# EAGLE design wolf_rev_c (EAGLE 7.6.0)
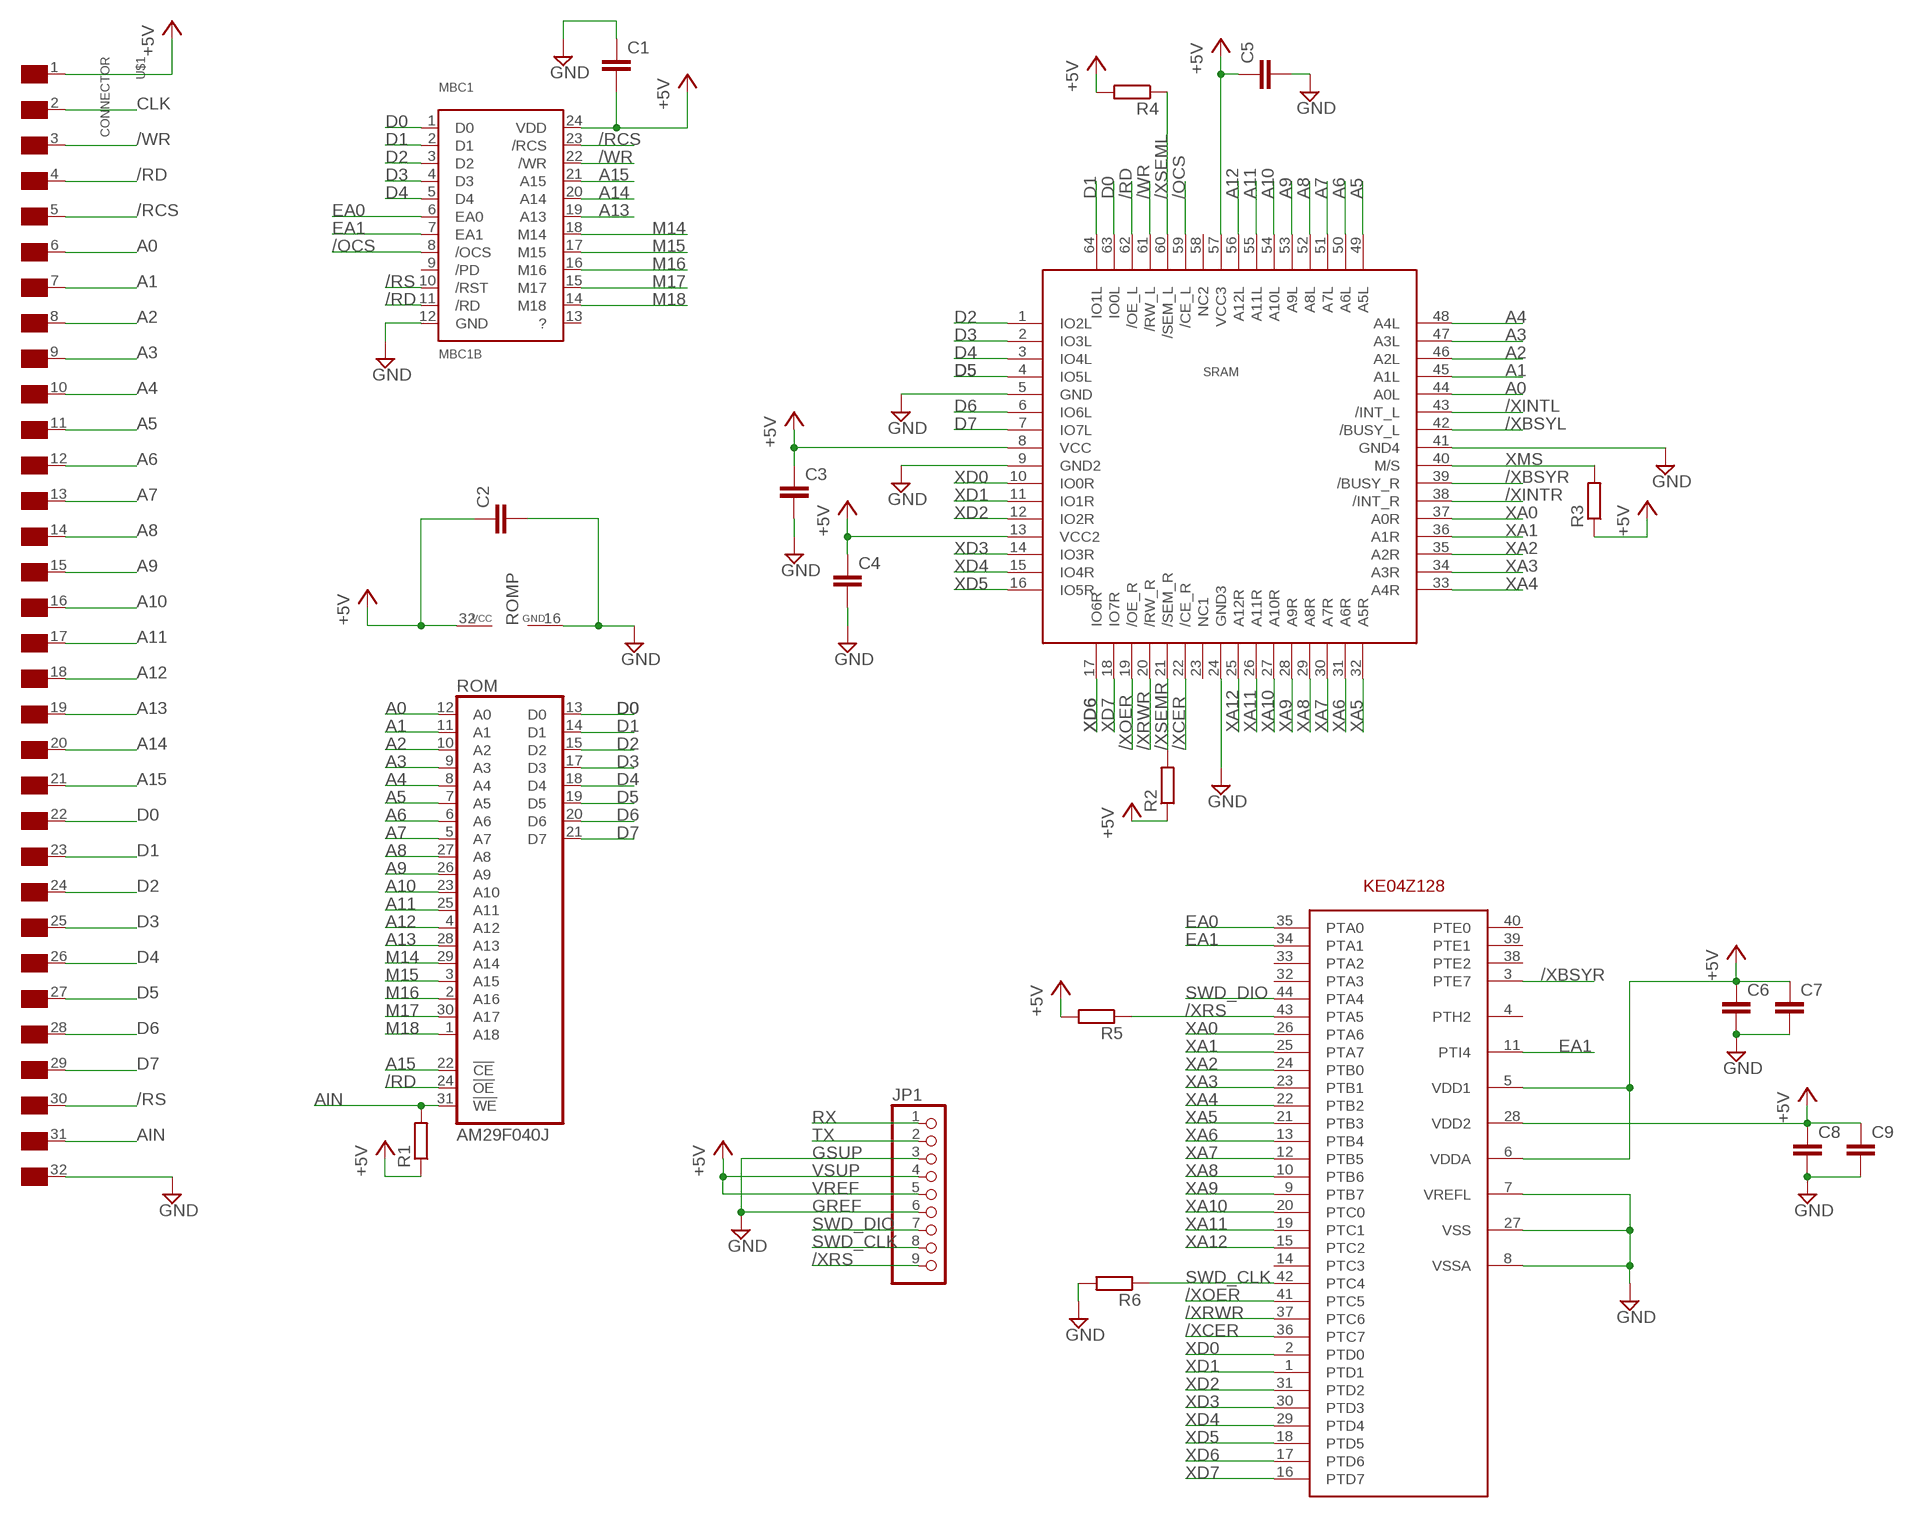
[diagram p0: schematic, sheet 1]

## Parts
C1  C-EUC0805  [C0805]
C2  C-EUC0805  [C0805]
C3  C-EUC0805  [C0805]
C4  C-EUC0805  [C0805]
C5  C-EUC0805  [C0805]
C6  C-EUC0805  [C0805]
C7  C-EUC0805  [C0805]
C8  C-EUC0805  [C0805]
C9  C-EUC0805  [C0805]
JP1  PINHD-1X9  [1X09]
KE04Z128  KE04Z128  KE04Z128VLD4  [TQFP44]
MBC1  MBC1B  [MBC1B]
R1  R-EU_R0805  [R0805]
R2  R-EU_R0805  [R0805]
R3  R-EU_R0805  [R0805]
R4  R-EU_R0805  [R0805]
R5  R-EU_R0805  [R0805]
R6  R-EU_R0805  [R0805]
ROM  AM29F040J  [PLCC32R]
SRAM  CY7C144E  [TQFP64]
U$1  CONNECTOR  [CONNECTOR]

## Nets
+5V [pwr]: C1.2 C2.1 C3.1 C4.1 C5.1 C6.1 C7.1 C8.1 C9.1 JP1.4 JP1.5 KE04Z128.5(VDD1) KE04Z128.6(VDDA) KE04Z128.28(VDD2) MBC1.24(VDD) R1.1 R2.1 R3.1 R4.2 R5.2 ROM.32(VCC) SRAM.8(VCC) SRAM.13(VCC2) SRAM.57(VCC3) U$1.1(VDD)
/OCS: MBC1.8(/OCS) SRAM.59(/CE_L)
/RCS: MBC1.23(/RCS) U$1.5(/RCS)
/RD: MBC1.11(/RD) ROM.24(!OE) SRAM.62(/OE_L) U$1.4(/RD)
/RS: MBC1.10(/RST) U$1.30(/RS)
/WR: MBC1.22(/WR) SRAM.61(/RW_L) U$1.3(/WR)
/XBSYL: SRAM.42(/BUSY_L)
/XBSYR: KE04Z128.3(PTE7) SRAM.39(/BUSY_R)
/XCER: KE04Z128.36(PTC7) SRAM.22(/CE_R)
/XINTL: SRAM.43(/INT_L)
/XINTR: SRAM.38(/INT_R)
/XOER: KE04Z128.41(PTC5) SRAM.19(/OE_R)
/XRS: JP1.9 KE04Z128.43(PTA5) R5.1
/XRWR: KE04Z128.37(PTC6) SRAM.20(/RW_R)
/XSEML: R4.1 SRAM.60(/SEM_L)
/XSEMR: R2.2 SRAM.21(/SEM_R)
A0: ROM.12(A0) SRAM.44(A0L) U$1.6(A0)
A1: ROM.11(A1) SRAM.45(A1L) U$1.7(A1)
A2: ROM.10(A2) SRAM.46(A2L) U$1.8(A2)
A3: ROM.9(A3) SRAM.47(A3L) U$1.9(A3)
A4: ROM.8(A4) SRAM.48(A4L) U$1.10(A4)
A5: ROM.7(A5) SRAM.49(A5L) U$1.11(A5)
A6: ROM.6(A6) SRAM.50(A6L) U$1.12(A6)
A7: ROM.5(A7) SRAM.51(A7L) U$1.13(A7)
A8: ROM.27(A8) SRAM.52(A8L) U$1.14(A8)
A9: ROM.26(A9) SRAM.53(A9L) U$1.15(A9)
A10: ROM.23(A10) SRAM.54(A10L) U$1.16(A10)
A11: ROM.25(A11) SRAM.55(A11L) U$1.17(A11)
A12: ROM.4(A12) SRAM.56(A12L) U$1.18(A12)
A13: MBC1.19(A13) ROM.28(A13) U$1.19(A13)
A14: MBC1.20(A14) U$1.20(A14)
A15: MBC1.21(A15) ROM.22(!CE) U$1.21(A15)
AIN: R1.2 ROM.31(!WE) U$1.31(VIN)
CLK: U$1.2(NC)
D0: MBC1.1(D0) ROM.13(D0) SRAM.63(IO0L) U$1.22(D0)
D1: MBC1.2(D1) ROM.14(D1) SRAM.64(IO1L) U$1.23(D1)
D2: MBC1.3(D2) ROM.15(D2) SRAM.1(IO2L) U$1.24(D2)
D3: MBC1.4(D3) ROM.17(D3) SRAM.2(IO3L) U$1.25(D3)
D4: MBC1.5(D4) ROM.18(D4) SRAM.3(IO4L) U$1.26(D4)
D5: ROM.19(D5) SRAM.4(IO5L) U$1.27(D5)
D6: ROM.20(D6) SRAM.6(IO6L) U$1.28(D6)
D7: ROM.21(D7) SRAM.7(IO7L) U$1.29(D7)
EA0: KE04Z128.35(PTA0) MBC1.6(EA0)
EA1: KE04Z128.11(PTI4) KE04Z128.34(PTA1) MBC1.7(EA1)
GND [gnd]: C1.1 C2.2 C3.2 C4.2 C5.2 C6.2 C7.2 C8.2 C9.2 JP1.3 JP1.6 KE04Z128.7(VREFL) KE04Z128.8(VSSA) KE04Z128.27(VSS) MBC1.12(GND) R6.2 ROM.16(GND) SRAM.5(GND) SRAM.9(GND2) SRAM.24(GND3) SRAM.41(GND4) U$1.32(GND)
M14: MBC1.18(M14) ROM.29(A14)
M15: MBC1.17(M15) ROM.3(A15)
M16: MBC1.16(M16) ROM.2(A16)
M17: MBC1.15(M17) ROM.30(A17)
M18: MBC1.14(M18) ROM.1(A18)
RX: JP1.1
SWD_CLK: JP1.8 KE04Z128.42(PTC4) R6.1
SWD_DIO: JP1.7 KE04Z128.44(PTA4)
TX: JP1.2
XA0: KE04Z128.26(PTA6) SRAM.37(A0R)
XA1: KE04Z128.25(PTA7) SRAM.36(A1R)
XA2: KE04Z128.24(PTB0) SRAM.35(A2R)
XA3: KE04Z128.23(PTB1) SRAM.34(A3R)
XA4: KE04Z128.22(PTB2) SRAM.33(A4R)
XA5: KE04Z128.21(PTB3) SRAM.32(A5R)
XA6: KE04Z128.13(PTB4) SRAM.31(A6R)
XA7: KE04Z128.12(PTB5) SRAM.30(A7R)
XA8: KE04Z128.10(PTB6) SRAM.29(A8R)
XA9: KE04Z128.9(PTB7) SRAM.28(A9R)
XA10: KE04Z128.20(PTC0) SRAM.27(A10R)
XA11: KE04Z128.19(PTC1) SRAM.26(A11R)
XA12: KE04Z128.15(PTC2) SRAM.25(A12R)
XD0: KE04Z128.2(PTD0) SRAM.10(IO0R)
XD1: KE04Z128.1(PTD1) SRAM.11(IO1R)
XD2: KE04Z128.31(PTD2) SRAM.12(IO2R)
XD3: KE04Z128.30(PTD3) SRAM.14(IO3R)
XD4: KE04Z128.29(PTD4) SRAM.15(IO4R)
XD5: KE04Z128.18(PTD5) SRAM.16(IO5R)
XD6: KE04Z128.17(PTD6) SRAM.17(IO6R)
XD7: KE04Z128.16(PTD7) SRAM.18(IO7R)
XMS: R3.2 SRAM.40(M/S)
Unconnected: KE04Z128.4(PTH2) KE04Z128.14(PTC3) KE04Z128.32(PTA3) KE04Z128.33(PTA2) KE04Z128.38(PTE2) KE04Z128.39(PTE1) KE04Z128.40(PTE0) MBC1.9(/PD) MBC1.13(?) SRAM.23(NC1) SRAM.58(NC2)

## Notes on the sheet
- GSUP
- VSUP
- VREF
- GREF

## Library data of the parts
C1-C9 = resistor:C-EU: CAPACITOR, European symbol
JP1 = pinhead:PINHD-1X9: PIN HEADER
KE04Z128 = wolf_rev_c:KE04Z128VLD4
MBC1 = wolf_rev_c:MBC1B: Nintendo Gameboy cartridge Memory Bank Controller (MBC) Specifically based on the MBC1-B chip
R1-R6 = resistor:R-EU_: RESISTOR, European symbol
ROM = am29-memory:AM29F040J: 4-Megabit FLASH MEMORY (512 K x 8 bit) 5 V-only
SRAM = wolf_rev_c:CY7C144E
U$1 = gameboy:CONNECTOR: Connector Pads for Gameboy Cartridges

## Net classes
1 pwr: width 0.406 mm
2 gnd: width 0.406 mm

## Board
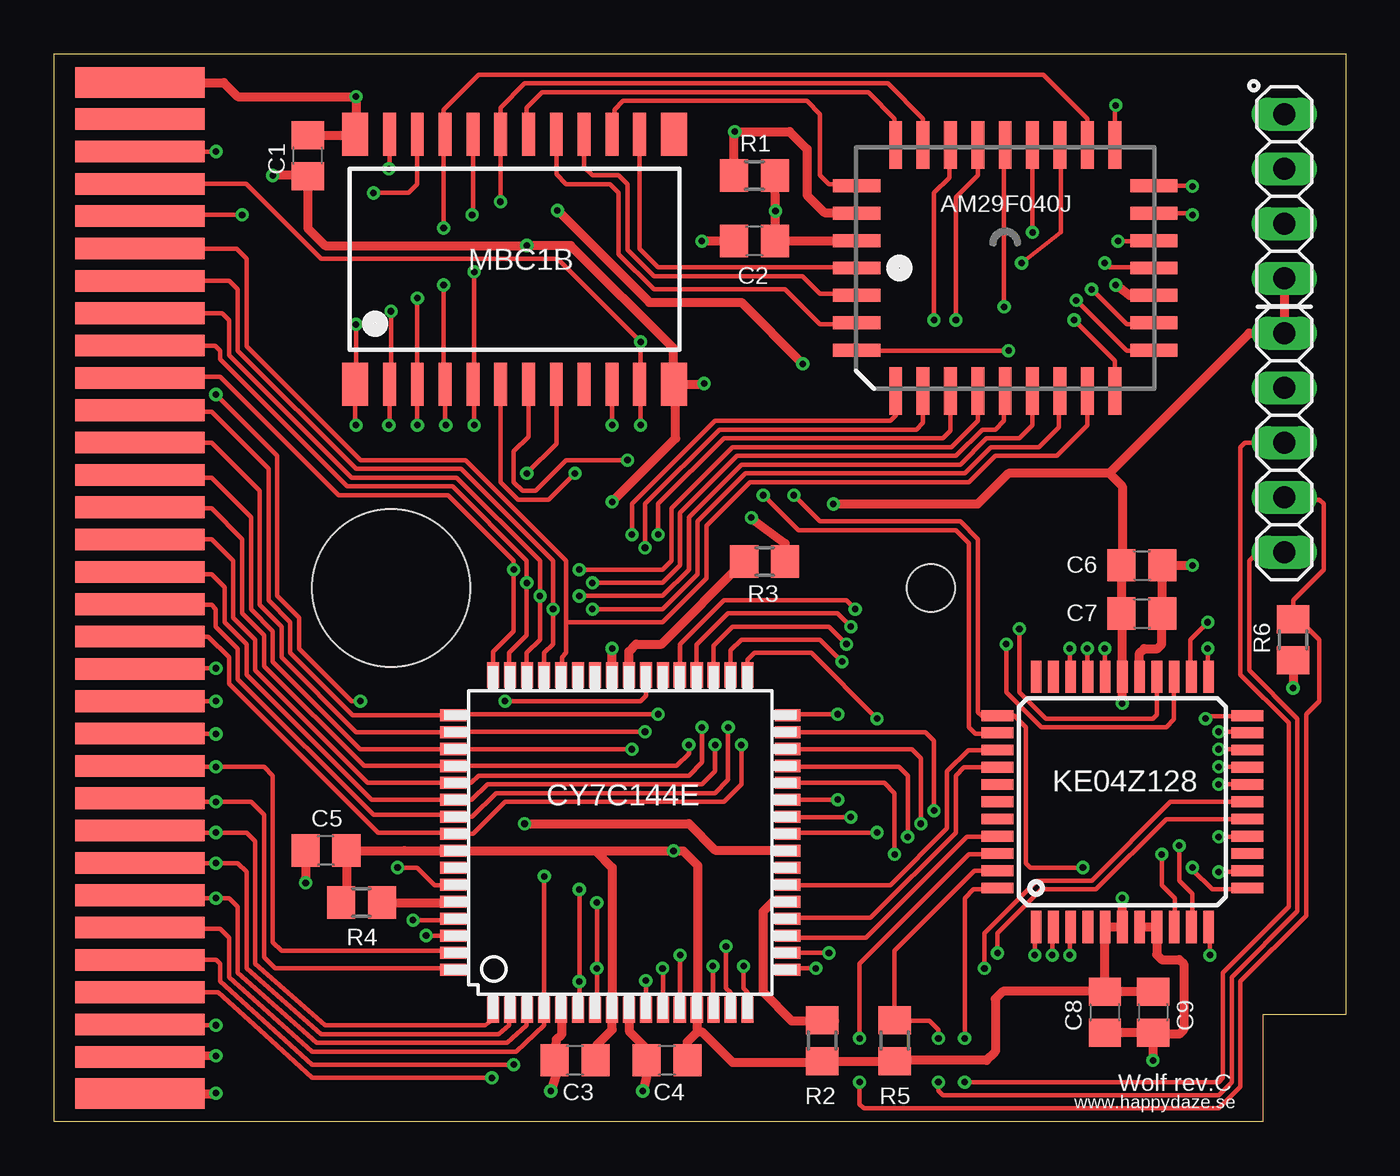
[diagram p1: board, top side]
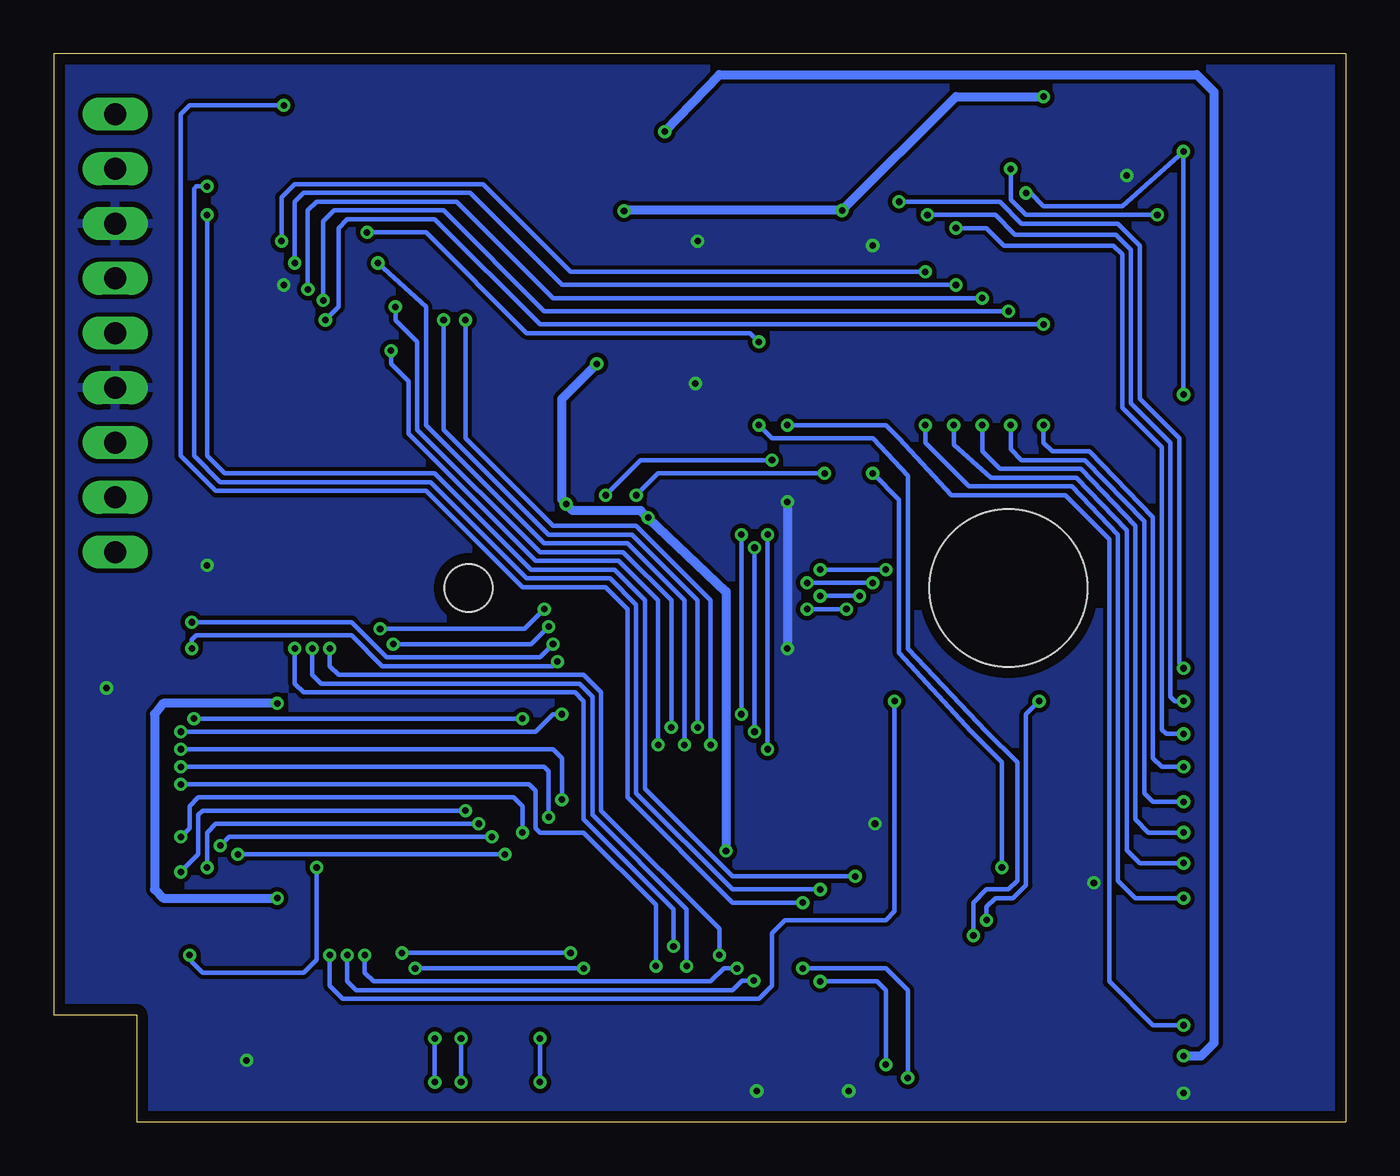
[diagram p2: board, bottom side, seen from below]

Size 59.94 x 49.53 mm. Coordinates in mm from the lower left corner, seen from the top.
Outline: 59.94,4.95 56.11,4.95 56.11,0 0,0 0,49.53 59.94,49.53 59.94,4.95
Copper layers (1*16): Top 0.035mm / dielectric 1.6mm / Bottom 0.035mm
Design rules "Elecrow_2-layer_PCB_eagle_rule *": minimum track width 8mil, minimum drill 12mil, track to track 8mil, track to pad 8mil, pad to pad 8mil, via to via 8mil, smd to smd 0mil, copper to edge 20mil, drill to drill 10mil, minimum pad ring 6mil, minimum via ring 6mil, stop-mask expansion 0mil, vias tented up to drill 100mil, thermal gap 10mil
Holes 7.3 mm at 15.65,24.75
Holes 2.2 mm at 40.7,24.75

### Footprints (pad centres in the part's own frame; a part is rotated, then mirrored left to right if it is on the bottom)
C0805 = smd 1.3 x 1.5: 1 -0.95,0; 2 0.95,0
1X09 = drill 1.016 long: 1 -10.16,0; 2 -7.62,0; 3 -5.08,0; 4 -2.54,0; 5 0,0; 6 2.54,0; 7 5.08,0; 8 7.62,0; 9 10.16,0
TQFP44 = smd 1.5 x 0.5: 1 -5.8,4; 2 -5.8,3.2; 3 -5.8,2.4; 4 -5.8,1.6; 5 -5.8,0.8; 6 -5.8,0; 7 -5.8,-0.8; 8 -5.8,-1.6; 9 -5.8,-2.4; 10 -5.8,-3.2; 11 -5.8,-4; 23 5.8,-4; 24 5.8,-3.2; 25 5.8,-2.4; 26 5.8,-1.6; 27 5.8,-0.8; 28 5.8,0; 29 5.8,0.8; 30 5.8,1.6; 31 5.8,2.4; 32 5.8,3.2; 33 5.8,4 | smd 0.5 x 1.5: 12 -4,-5.8; 13 -3.2,-5.8; 14 -2.4,-5.8; 15 -1.6,-5.8; 16 -0.8,-5.8; 17 0,-5.8; 18 0.8,-5.8; 19 1.6,-5.8; 20 2.4,-5.8; 21 3.2,-5.8; 22 4,-5.8; 34 4,5.8; 35 3.2,5.8; 36 2.4,5.8; 37 1.6,5.8; 38 0.8,5.8; 39 0,5.8; 40 -0.8,5.8; 41 -1.6,5.8; 42 -2.4,5.8; 43 -3.2,5.8; 44 -4,5.8
MBC1B = smd 2 x 1.2: 1 1,-0.6; 12 1,-15.39; 13 12.6,-15.39; 24 12.6,-0.6 | smd 2 x 0.6: 2 1,-2.19; 3 1,-3.48; 4 1,-4.77; 5 1,-6.06; 6 1,-7.35; 7 1,-8.64; 8 1,-9.93; 9 1,-11.22; 10 1,-12.51; 11 1,-13.8; 14 12.6,-13.8; 15 12.6,-12.51; 16 12.6,-11.22; 17 12.6,-9.93; 18 12.6,-8.64; 19 12.6,-7.35; 20 12.6,-6.06; 21 12.6,-4.77; 22 12.6,-3.48; 23 12.6,-2.19
R0805 = smd 1.3 x 1.5: 1 -0.95,0; 2 0.95,0
PLCC32R = smd 0.6 x 2.2: 1 0,6.9; 2 -1.27,6.9; 3 -2.54,6.9; 4 -3.81,6.9; 14 -3.81,-6.9; 15 -2.54,-6.9; 16 -1.27,-6.9; 17 0,-6.9; 18 1.27,-6.9; 19 2.54,-6.9; 20 3.81,-6.9; 30 3.81,6.9; 31 2.54,6.9; 32 1.27,6.9 | smd 2.2 x 0.6: 5 -5.7,5.08; 6 -5.7,3.81; 7 -5.7,2.54; 8 -5.7,1.27; 9 -5.7,0; 10 -5.7,-1.27; 11 -5.7,-2.54; 12 -5.7,-3.81; 13 -5.7,-5.08; 21 5.7,-5.08; 22 5.7,-3.81; 23 5.7,-2.54; 24 5.7,-1.27; 25 5.7,0; 26 5.7,1.27; 27 5.7,2.54; 28 5.7,3.81; 29 5.7,5.08
TQFP64 = smd 1.194 x 0.559: 1 -7.76,5.905; 2 -7.76,5.118; 3 -7.76,4.331; 4 -7.76,3.543; 5 -7.76,2.756; 6 -7.76,1.968; 7 -7.76,1.181; 8 -7.76,0.394; 9 -7.76,-0.394; 10 -7.76,-1.181; 11 -7.76,-1.968; 12 -7.76,-2.756; 13 -7.76,-3.543; 14 -7.76,-4.331; 15 -7.76,-5.118; 16 -7.76,-5.905; 33 7.76,-5.905; 34 7.76,-5.118; 35 7.76,-4.331; 36 7.76,-3.543; 37 7.76,-2.756; 38 7.76,-1.968; 39 7.76,-1.181; 40 7.76,-0.394; 41 7.76,0.394; 42 7.76,1.181; 43 7.76,1.968; 44 7.76,2.756; 45 7.76,3.543; 46 7.76,4.331; 47 7.76,5.118; 48 7.76,5.905 | smd 0.559 x 1.194: 17 -5.905,-7.76; 18 -5.118,-7.76; 19 -4.331,-7.76; 20 -3.543,-7.76; 21 -2.756,-7.76; 22 -1.968,-7.76; 23 -1.181,-7.76; 24 -0.394,-7.76; 25 0.394,-7.76; 26 1.181,-7.76; 27 1.968,-7.76; 28 2.756,-7.76; 29 3.543,-7.76; 30 4.331,-7.76; 31 5.118,-7.76; 32 5.905,-7.76; 49 5.905,7.76; 50 5.118,7.76; 51 4.331,7.76; 52 3.543,7.76; 53 2.756,7.76; 54 1.968,7.76; 55 1.181,7.76; 56 0.394,7.76; 57 -0.394,7.76; 58 -1.181,7.76; 59 -1.968,7.76; 60 -2.756,7.76; 61 -3.543,7.76; 62 -4.331,7.76; 63 -5.118,7.76; 64 -5.905,7.76
CONNECTOR = smd 1.4 x 6: 1 0.7,-3; 32 47.6,-3 | smd 1 x 6: 2 2.4,-3; 3 3.9,-3; 4 5.4,-3; 5 6.9,-3; 6 8.4,-3; 7 9.9,-3; 8 11.4,-3; 9 12.9,-3; 10 14.4,-3; 11 15.9,-3; 12 17.4,-3; 13 18.9,-3; 14 20.4,-3; 15 21.9,-3; 16 23.4,-3; 17 24.9,-3; 18 26.4,-3; 19 27.9,-3; 20 29.4,-3; 21 30.9,-3; 22 32.4,-3; 23 33.9,-3; 24 35.4,-3; 25 36.9,-3; 26 38.4,-3; 27 39.9,-3; 28 41.4,-3; 29 42.9,-3; 30 44.4,-3; 31 45.9,-3

### Placement (x,y rotation side)
C1  11.79,44.81 90 top
C2  32.51,40.84 180 top
C3  24.18,2.84 180 top
C4  28.45,2.84 180 top
C5  12.62,12.57 180 top
C6  50.5,25.81 0 top
C7  50.5,23.57 0 top
C8  48.77,5.08 270 top
C9  51,5.08 270 top
JP1  57.1,36.58 270 top
KE04Z128  49.58,14.83 90 top
MBC1  13.39,33.2 90 top
R1  32.51,43.89 180 top
R2  35.66,3.76 90 top
R3  32.99,25.99 180 top
R4  14.27,10.16 180 top
R5  39.01,3.76 270 top
R6  57.51,22.35 270 top
ROM  44.15,39.6 90 top
SRAM  26.29,12.95 90 top
U$1  7,48.9 270 top

### Tracks (layer width: path | path; a pad name or v marks a point on that pad's centre or on a via)
+5V  (via drill 0.3 pad 0.3)
  Top 0.406: C3.1 25.21,3.57 25.91,4.27 SRAM.8 25.91,5.21 25.91,11.79 25.13,12.56 | C4.1 29.4,3.69 29.87,4.17 | 29.87,4.17 29.87,5.16 SRAM.13 29.87,5.23 29.87,11.89 29.2,12.56 v28.75,12.56 25.13,12.56 | 16.26,12.57 C5.1 13.57,9.81 R4.2 | 16.26,12.57 18.52,12.57 SRAM.57 25.13,12.56 | 16.24,12.56 16.26,12.57 | C1.2 13.94,45.76 MBC1.24 14.02,45.83 v14.02,47.55 8.53,47.55 7.88,48.2 U$1.1 | 33.48,42.05 C2.1 33.49,40.87 ROM.32 | 33.48,42.05 v33.49,42.24 | v33.49,42.24 R1.1 | v23.37,42.27 27.64,38 31.9,38 v34.75,35.15 | v33.49,42.24 33.49,42.06 33.48,42.05 | v36.17,28.65 42.88,28.65 44.3,30.07 48.97,30.07 | v32.37,28.02 32.33,28.02 33.93,26.82 R3.1 | 29.87,4.17 30.07,4.17 31.5,2.74 36.2,2.74 R2.1 R5.2 39.66,2.85 43.28,2.85 43.69,3.25 43.69,5.69 44.04,6.04 48.78,6.04 | C9.1 C8.1 48.78,6.04 | 48.97,30.07 49.58,29.46 49.58,25.84 C6.1 C7.1 49.58,23.54 KE04Z128.28 | 48.97,30.07 55.47,36.58 JP1.5 JP1.4 | 49.55,20.67 KE04Z128.28 | v49.58,19.41 KE04Z128.28 | KE04Z128.6 49.58,8.94 | KE04Z128.6 KE04Z128.5 48.78,6.04 | KE04Z128.6 v49.58,10.36
  Bottom 0.406: v14.02,47.55 18.09,47.55 v23.37,42.27 33.46,42.27 v33.49,42.24 | v28.75,12.56 28.75,24.59 v32.37,28.02 32.72,28.35 35.87,28.35 v36.17,28.65 36.37,28.85 36.37,33.53 v34.75,35.15 | v49.58,19.41 54.86,19.41 55.27,18.9 55.27,10.77 54.86,10.36 v49.58,10.36
/OCS  (via drill 0.3 pad 0.3)
  Top 0.203: MBC1.8 23.32,31.44 v21.95,30.07 | SRAM.59 18.52,10.97 17.68,10.97 16.87,11.79 v15.95,11.79
  Bottom 0.203: v15.95,11.79 15.95,16.66 17.37,18.09 20.73,21.74 20.73,28.85 v21.95,30.07
/RCS  (via drill 0.3 pad 0.3)
  Top 0.203: MBC1.23 15.58,44.23 v15.54,44.2 | v8.74,42.06 4.06,42.06 U$1.5
  Bottom 0.203: v15.54,44.2 15.54,42.77 14.83,42.06 v8.74,42.06
/RD  (via drill 0.3 pad 0.3)
  Top 0.203: U$1.4 8.93,43.5 12.39,40.03 23.37,40.03 v27.23,36.17 27.23,34.24 MBC1.11 27.23,34.16 v27.23,32.31 | SRAM.62 17.29,8.62 v17.27,8.64 | v45.41,41.25 ROM.24
  Bottom 0.203: v17.27,8.64 17.27,10.16 16.66,10.77 15.65,10.77 15.24,11.18 15.24,16.66 16.66,18.09 20.32,21.95 20.32,29.97 21.95,31.7 26.62,31.7 v27.23,32.31 | v27.23,36.17 27.64,36.58 38,36.58 42.67,41.25 v45.41,41.25
/RS  (via drill 0.3 pad 0.3)
  Top 0.203: v7.52,4.47 4.03,4.47 U$1.30 | v25.91,32.31 25.9,32.31 MBC1.10
  Bottom 0.203: v25.91,32.31 21.34,32.31 20.73,31.7 18.29,29.06 13.01,29.06 10.97,27.03 10.97,6.5 8.94,4.47 v7.52,4.47
/WR  (via drill 0.3 pad 0.3)
  Top 0.203: U$1.3 v7.53,45 | MBC1.22 16.87,43.48 16.46,43.08 v14.83,43.08 | MBC1.22 | v7.52,33.73 10.36,30.89 10.36,24.38 11.38,23.37 11.38,21.95 13.82,19.51 v14.22,19.51 | v16.66,9.35 18.47,9.35 SRAM.61
  Bottom 0.203: v14.83,43.08 14.63,43.08 14.02,42.47 10.36,42.47 v7.53,45 7.53,33.52 v7.52,33.73 | v16.66,9.35 16.66,9.96 16.26,10.36 15.44,10.36 14.83,10.97 14.83,18.9 v14.22,19.51
/XBSYR  (via drill 0.3 pad 0.3)
  Top 0.203: v47.14,7.72 47.14,8.99 KE04Z128.3 | SRAM.39 27.47,19.75 27.23,19.51 v20.93,19.51
  Bottom 0.203: v47.14,7.72 47.14,6.3 46.53,5.69 27.23,5.69 26.62,6.3 26.62,8.74 26.01,9.35 21.34,9.35 20.93,9.75 v20.93,19.51
/XCER
  Top 0.203: KE04Z128.36 42.43,17.23 41.45,16.26 41.45,13.61 38.81,10.97 34.06,10.97 SRAM.22
/XOER
  Top 0.203: SRAM.19 34.14,8.53 37.69,8.53 42.37,13.21 43.76,13.21 KE04Z128.41
/XRS  (via drill 0.3 pad 0.3)
  Top 0.203: KE04Z128.43 42.72,11.63 39.01,7.92 R5.1 39.05,4.67 40.64,4.67 41.05,4.27 v41.05,3.86 | JP1.9 55.88,26.42 55.47,26.01 55.47,20.93 57.71,18.69 57.71,9.75 54.66,6.71 54.66,1.83 54.05,1.22 41.25,1.22 41.05,1.42 v41.05,1.83
  Bottom 0.203: v41.05,1.83 v41.05,3.86
/XRWR
  Top 0.203: KE04Z128.37 42.24,16.43 41.86,16.05 41.86,13.41 37.9,9.45 34.09,9.45 SRAM.20 34.11,9.35
/XSEML
  Top 0.406: R4.1 18.49,10.16 SRAM.60
/XSEMR
  Top 0.406: SRAM.21 34.01,10.16 33.33,10.16 32.92,9.75 32.92,5.99 34.24,4.67 36.24,4.67 R2.2
A0
  Top 0.203: U$1.6 8.47,40.5 8.94,40.03 8.94,35.97 14.22,30.68 19.1,30.68 23.77,26.01 23.77,23.16 | SRAM.44 23.57,20.75 23.57,21.54 23.77,21.74 23.77,23.16 | ROM.12 47.95,32.31 46.53,30.89 43.69,30.89 42.47,29.67 32.31,29.67 30.28,27.64 30.28,25.2 28.25,23.16 23.77,23.16
A1  (via drill 0.3 pad 0.3)
  Top 0.203: U$1.7 8.14,39 8.53,38.61 8.53,35.76 14.02,30.28 18.9,30.28 23.16,26.01 v23.16,23.77 23.16,22.15 22.76,21.74 22.76,20.73 SRAM.45 | ROM.11 46.63,33.85 46.63,32.21 45.72,31.29 43.48,31.29 42.27,30.07 32.11,30.07 29.87,27.84 29.87,25.4 28.25,23.77 v24.99,23.77
  Bottom 0.203: v23.16,23.77 v24.99,23.77
A2  (via drill 0.3 pad 0.3)
  Top 0.203: U$1.8 7.81,37.5 8.13,37.19 8.13,35.56 13.82,29.87 18.69,29.87 22.55,26.01 v22.55,24.38 22.55,22.35 21.95,21.74 21.95,20.73 SRAM.46 | ROM.10 45.41,32.31 44.81,31.7 43.28,31.7 42.06,30.48 31.9,30.48 29.46,28.04 29.46,25.6 28.25,24.38 v24.38,24.38
  Bottom 0.203: v22.55,24.38 v24.38,24.38
A3  (via drill 0.3 pad 0.3)
  Top 0.203: U$1.9 7.49,36 7.72,35.76 7.72,35.36 13.61,29.46 18.49,29.46 21.95,26.01 v21.95,24.99 21.95,22.55 21.13,21.74 21.13,20.75 SRAM.47 | ROM.9 44.09,33.85 44.09,32.51 43.69,32.11 43.08,32.11 41.86,30.89 31.7,30.89 29.06,28.25 29.06,25.81 28.25,24.99 v24.99,24.99
  Bottom 0.203: v21.95,24.99 v24.99,24.99
A4  (via drill 0.3 pad 0.3)
  Top 0.203: U$1.10 4.04,34.54 7.72,34.54 13.21,29.06 18.29,29.06 21.34,26.01 v21.34,25.6 21.34,22.76 20.38,21.81 SRAM.48 | ROM.8 42.88,32.51 41.66,31.29 31.5,31.29 28.65,28.45 28.65,26.01 28.25,25.6 v24.38,25.6
  Bottom 0.203: v21.34,25.6 v24.38,25.6
A5  (via drill 0.3 pad 0.3)
  Top 0.203: U$1.11 4.08,32.92 7.32,32.92 9.96,30.28 9.96,24.18 10.97,23.16 10.97,21.74 13.86,18.86 SRAM.49 18.57,18.9 v28.04,18.9 | ROM.7 41.6,32.05 41.25,31.7 31.09,31.7 28.04,28.65 v28.04,27.23
  Bottom 0.203: v28.04,27.23 v28.04,18.9
A6  (via drill 0.3 pad 0.3)
  Top 0.203: U$1.12 7.32,31.5 9.55,29.26 9.55,23.98 10.57,22.96 10.57,21.54 14.03,18.07 SRAM.50 18.54,18.09 v27.43,18.09 | ROM.6 40.34,32.41 40.03,32.11 30.89,32.11 27.43,28.65 v27.43,26.62
  Bottom 0.203: v27.43,26.62 v27.43,18.09
A7  (via drill 0.3 pad 0.3)
  Top 0.203: U$1.13 4.13,29.87 7.32,29.87 9.14,28.04 9.14,23.77 10.16,22.76 10.16,21.34 14.21,17.29 SRAM.51 18.54,17.27 v26.82,17.27 | ROM.5 39.06,32.77 38.81,32.51 30.68,32.51 26.82,28.65 v26.82,27.23
  Bottom 0.203: v26.82,27.23 v26.82,17.27
A8  (via drill 0.3 pad 0.3)
  Top 0.203: 3.95,28.45 7.32,28.45 8.74,27.03 8.74,23.57 9.75,22.55 9.75,21.13 14.39,16.5 SRAM.52 28.89,16.5 29.46,17.07 v29.46,17.48 | 3.45,28.45 3.95,28.45 | 3.95,28.45 U$1.14 | v40.84,37.19 40.84,43.08 41.55,43.79 41.55,45.25 ROM.27
  Bottom 0.203: v29.46,17.48 29.46,24.18 32.92,27.64 36.78,27.64 40.84,31.7 v40.84,37.19
A9  (via drill 0.3 pad 0.3)
  Top 0.203: U$1.15 4.03,27.03 7.32,27.03 8.33,26.01 8.33,23.37 9.35,22.35 9.35,20.93 14.57,15.71 SRAM.53 19.37,15.71 19.71,16.05 29.46,16.05 30.07,16.66 v30.07,18.29 | v41.86,37.19 41.86,42.88 42.88,43.89 ROM.26
  Bottom 0.203: v30.07,18.29 30.07,24.18 33.12,27.23 36.98,27.23 41.86,32.11 v41.86,37.19 41.86,36.78
A10  (via drill 0.3 pad 0.3)
  Top 0.203: U$1.16 4.1,25.4 7.32,25.4 7.92,24.79 7.92,23.16 8.94,22.15 8.94,20.73 14.74,14.92 SRAM.54 19.39,14.92 20.12,15.65 30.07,15.65 30.68,16.26 v30.68,17.48 | v44.91,39.83 46.74,41.25 46.74,45.25 ROM.23
  Bottom 0.203: v30.68,17.48 30.68,24.18 33.33,26.82 37.19,26.82 42.67,32.31 42.67,37.8 v44.91,39.83
A11  (via drill 0.3 pad 0.3)
  Top 0.203: U$1.17 4.02,23.98 7.32,23.98 7.52,23.77 7.52,22.96 8.53,21.95 8.53,20.52 14.83,14.22 18.44,14.22 SRAM.55 19.42,14.13 20.52,15.24 30.68,15.24 31.29,15.85 v31.29,18.29 | v44.09,37.8 44.09,45.25 ROM.25
  Bottom 0.203: v31.29,18.29 31.29,24.18 33.53,26.42 37.39,26.42 43.08,32.11 43.08,36.17 44.09,37.19 v44.09,37.8
A12  (via drill 0.3 pad 0.3)
  Top 0.203: U$1.18 7.17,22.5 8.13,21.54 8.13,20.32 15.04,13.41 18.47,13.41 SRAM.56 19.44,13.35 20.93,14.83 31.09,14.83 31.9,15.65 v31.9,17.48 | v44.3,35.76 37.27,35.76 ROM.4
  Bottom 0.203: v31.9,17.48 31.9,24.18 33.73,26.01 37.59,26.01 43.48,31.9 43.48,34.34 44.3,35.15 v44.3,35.76
A13  (via drill 0.3 pad 0.3)
  Top 0.203: v20.73,42.67 20.73,45.79 MBC1.19 | v7.52,21.03 4.03,21.03 U$1.19 | MBC1.19 20.74,46.52 20.73,46.53 | ROM.28 40.34,46.53 38.71,48.16 21.84,48.16 20.73,47.04 20.73,45.81 MBC1.19
  Bottom 0.203: v20.73,42.67 16.05,42.67 15.04,41.66 10.57,41.66 9.55,40.64 9.55,33.53 7.72,31.7 7.72,21.23 v7.52,21.03
A14  (via drill 0.3 pad 0.3)
  Top 0.203: v7.52,19.51 U$1.20 | v19.41,42.06 19.45,42.06 MBC1.20
  Bottom 0.203: v19.41,42.06 16.26,42.06 15.34,41.15 10.67,41.15 9.96,40.44 9.96,33.33 8.13,31.5 8.13,19.71 7.92,19.51 v7.52,19.51
A15  (via drill 0.3 pad 0.3)
  Top 0.203: v18.09,41.45 18.09,45.73 MBC1.21 18.09,45.87 18.09,46.94 19.71,48.56 45.92,48.56 47.95,46.53 ROM.22 | v7.52,17.98 4.02,17.98 U$1.21
  Bottom 0.203: v18.09,41.45 16.66,41.45 15.85,40.64 10.77,40.64 10.36,40.23 10.36,33.12 8.53,31.29 8.53,18.19 8.33,17.98 v7.52,17.98
AIN  (via drill 0.3 pad 0.3)
  Top 0.203: 37.12,42.27 ROM.31
  Top 0.406: R1.2 31.56,45.89 v31.6,45.92 34.14,45.92 34.95,45.11 34.95,42.98 35.76,42.16 37.22,42.16 ROM.31 | v7.52,3.05 7.5,3.05 U$1.31
  Bottom 0.406: v31.6,45.92 29.06,48.56 6.91,48.56 6.1,47.75 6.1,3.65 6.71,3.03 7.5,3.03 v7.52,3.05
D0  (via drill 0.3 pad 0.3)
  Top 0.203: SRAM.63 18.44,7.92 10.57,7.92 10.16,8.33 10.16,16.05 9.75,16.46 v7.52,16.46 4.04,16.46 U$1.22 | v14.02,32.31 13.99,32.34 MBC1.1 14.02,34.23 v14.02,36.98 | ROM.13 49.23,35.31 v47.35,37.19
  Bottom 0.203: v14.02,32.31 14.02,31.5 13.61,31.09 11.89,31.09 8.94,28.04 8.94,16.87 8.53,16.46 v7.52,16.46 | v14.02,36.98 37.39,36.98 42.27,41.86 46.33,41.86 46.74,41.45 46.74,37.8 v47.35,37.19
D1  (via drill 0.3 pad 0.3)
  Top 0.203: SRAM.64 18.47,7.11 10.26,7.11 9.75,7.62 9.75,14.22 9.14,14.83 v7.52,14.83 4.17,14.83 U$1.23 | v15.54,32.31 15.58,32.34 MBC1.2 15.65,34.27 v15.65,37.59 | v47.45,38.1 49.78,35.76 51.02,35.76 ROM.14
  Bottom 0.203: v15.54,32.31 15.54,31.19 15.04,30.68 12.09,30.68 9.35,27.84 9.35,15.24 8.94,14.83 v7.52,14.83 | v15.65,37.59 37.19,37.59 41.86,42.27 46.94,42.27 47.45,41.76 v47.45,38.1
D2  (via drill 0.3 pad 0.3)
  Top 0.203: SRAM.1 20.32,5.13 20.32,4.67 20.02,4.47 12.6,4.47 9.35,7.32 9.35,13.01 8.94,13.41 v7.52,13.41 4.09,13.41 U$1.24 | MBC1.3 v16.87,32.31 | v16.87,32.31 | v16.87,38.2 MBC1.3 | MBC1.3 | ROM.15 50.97,36.98 49.78,36.98 v48.16,38.61
  Bottom 0.203: v16.87,32.31 16.87,31.09 16.05,30.28 12.29,30.28 9.75,27.64 9.75,14.02 9.14,13.41 v7.52,13.41 | v16.87,38.2 36.78,38.2 41.25,42.67 47.75,42.67 48.16,42.27 v48.16,38.61
D3  (via drill 0.3 pad 0.3)
  Top 0.203: SRAM.2 21.13,5.16 21.13,4.47 20.62,4.06 12.39,4.06 8.94,7.11 8.94,11.58 8.53,11.99 v7.52,11.99 U$1.25 | v18.19,32.31 18.16,32.34 MBC1.4 18.09,34.27 v18.09,38.81 | ROM.17 51.02,39.62 48.97,39.62 v48.77,39.83
  Bottom 0.203: v18.19,32.31 18.19,31.39 16.46,29.87 12.5,29.87 10.16,27.43 10.16,12.6 9.55,11.99 v7.52,11.99 | v18.09,38.81 36.37,38.81 40.64,43.08 48.36,43.08 48.77,42.67 v48.77,39.83
D4  (via drill 0.3 pad 0.3)
  Top 0.203: SRAM.3 21.95,5.18 21.95,4.47 21.03,3.66 12.19,3.66 8.53,6.91 8.53,9.96 8.13,10.36 v7.52,10.36 4.14,10.36 U$1.26 | v19.51,32.31 19.51,34.2 MBC1.5 19.51,34.26 v19.51,39.42 | 50.62,40.87 ROM.18 51.02,40.84 v49.38,40.84
  Bottom 0.203: v7.52,10.36 9.75,10.36 10.57,11.18 10.57,27.23 12.7,29.46 17.48,29.46 19.51,31.5 v19.51,32.31 | v19.51,39.42 35.97,39.42 40.03,43.48 48.77,43.48 49.38,42.88 v49.38,40.84
D5  (via drill 0.3 pad 0.3)
  Top 0.203: U$1.27 4.21,9 4.27,8.94 7.72,8.94 8.13,8.53 8.13,6.71 11.99,3.25 21.44,3.25 22.76,4.47 SRAM.4 22.76,5.21 v22.76,11.38 | ROM.19 52.76,42.14 v52.83,42.06
  Bottom 0.203: v52.83,42.06 52.83,30.89 52.02,30.07 42.27,30.07 37.8,25.6 33.93,25.6 32.51,24.18 32.51,15.44 28.45,11.38 v22.76,11.38
D6  (via drill 0.3 pad 0.3, 0.3 pad 0.61)
  Top 0.203: U$1.28 7.54,7.5 7.72,7.32 7.72,6.5 11.99,2.64 v21.34,2.64 | ROM.20 52.81,43.41 v52.83,43.38 | SRAM.6 24.38,5.26 v24.38,6.5 v24.38,10.77
  Bottom 0.203: v21.34,2.64 21.34,6.1 21.74,6.5 v24.38,6.5 | v52.83,43.38 53.34,43.38 53.44,43.28 53.44,30.89 52.22,29.67 42.47,29.67 38,25.2 34.14,25.2 32.92,23.98 32.92,15.24 28.45,10.77 v24.38,10.77
D7  (via drill 0.3 pad 0.3, 0.3 pad 0.61)
  Top 0.203: U$1.29 7.61,6 9.55,4.27 11.99,2.03 v20.32,2.03 | 25.09,5.21 SRAM.7 25.2,5.28 v25.2,7.11 v25.2,10.16 | ROM.21 49.23,46.99 v49.28,47.14
  Bottom 0.203: v20.32,2.03 20.32,6.1 21.34,7.11 v25.2,7.11 | v49.28,47.14 53.65,47.14 54.05,46.74 54.05,30.89 52.43,29.26 42.67,29.26 38.2,24.79 34.34,24.79 33.33,23.77 33.33,15.04 28.45,10.16 v25.2,10.16
EA0  (via drill 0.3 pad 0.3)
  Top 0.203: MBC1.6 20.74,29.66 21.54,28.85 22.96,28.85 v24.18,30.07 | v32.92,29.06 34.54,27.43 41.86,27.43 42.47,26.82 42.47,18.29 42.77,17.98 43.73,17.98 KE04Z128.35
  Bottom 0.203: v24.18,30.07 31.9,30.07 v32.92,29.06
EA1  (via drill 0.3 pad 0.3)
  Top 0.203: MBC1.7 22.03,31.78 21.34,31.09 21.34,29.67 21.74,29.26 22.35,29.26 23.77,30.68 v26.62,30.68 | v34.34,29.06 35.56,27.84 42.06,27.84 42.88,27.03 42.88,19 43.08,18.8 43.74,18.8 KE04Z128.34 44.56,18.83 45.11,18.29 45.11,11.99 45.31,11.79 v47.75,11.79 | v53.65,7.72 53.65,8.97 KE04Z128.11
  Bottom 0.203: v26.62,30.68 32.72,30.68 v34.34,29.06 | v47.75,11.79 47.75,7.52 48.36,6.91 53.03,6.91 53.54,7.42 53.54,7.62 v53.65,7.72
GND  (via drill 0.3 pad 0.3)
  Top 0.406: SRAM.9 26.72,5.16 26.72,4.17 27.5,3.39 C4.2 27.5,2.1 v27.33,1.42 | 4.08,1.22 U$1.32 7.5,1.3 v7.52,1.32 | MBC1.12 28.75,34.22 28.75,35.87 23.98,40.64 v21.95,40.64 12.6,40.64 11.79,41.45 C1.1 11.38,43.89 v10.16,43.89 | C2.2 v30.07,40.84 | MBC1.12 28.85,34.12 28.85,31.7 v25.91,28.75 | SRAM.41 25.89,21.83 v25.91,21.95 | ROM.16 49.91,38.33 v49.28,38.81 | C5.2 11.67,11.29 v11.68,11.07 | SRAM.5 23.57,5.16 23.57,4.06 23.31,3.8 C3.2 23.31,2.17 v23.06,1.42 | v21.84,13.82 29.46,13.82 30.68,12.6 34.01,12.6 SRAM.24 | v52.83,25.81 C6.2 C7.2 51.41,23.54 51.41,22.15 51.21,21.95 50.6,21.95 50.38,21.73 KE04Z128.27 | KE04Z128.7 KE04Z128.8 51.18,7.75 51.41,7.52 52.22,7.52 52.43,7.32 52.43,4.27 52.22,4.06 51.07,4.06 C9.2 | MBC1.12 30.13,34.2 v30.18,34.24 | R6.2 v57.51,20.12 | C9.2 C8.2 | C9.2 v51,2.85
  Bottom 0.406: v25.91,28.75 v25.91,21.95
  pour Bottom: 0.2,49.28 59.74,49.28 59.74,5.18 55.68,5.18 55.68,0.2 0.2,0.2
M14
  Top 0.203: ROM.29 39.01,45.35 39.01,46.53 37.8,47.75 22.66,47.75 21.95,47.04 21.95,45.88 MBC1.18
M15
  Top 0.203: MBC1.17 23.32,43.94 23.77,43.48 25.81,43.48 26.21,43.08 26.21,40.23 27.84,38.61 33.93,38.61 35.56,36.98 37.17,36.98 ROM.3
M16
  Top 0.203: 36.78,38.2 37.12,38.2 ROM.2 37.17,38.41 35.56,38.41 34.75,39.22 27.84,39.22 26.62,40.44 26.62,43.48 26.21,43.89 24.99,43.89 24.61,44.28 MBC1.16
M17
  Top 0.203: MBC1.15 26.01,45.91 26.01,46.94 26.42,47.35 34.95,47.35 35.56,46.74 35.56,43.89 35.97,43.48 37.17,43.48 ROM.30
M18
  Top 0.203: ROM.1 37.22,39.62 28.04,39.62 27.19,40.48 MBC1.14
SWD_CLK  (via drill 0.3 pad 0.3)
  Top 0.203: JP1.8 57.1,28.85 58.73,28.85 58.93,28.65 58.93,25.6 57.51,24.18 R6.1 57.77,23.3 58.73,22.35 58.73,19.51 58.12,18.9 58.12,9.55 55.07,6.5 55.07,1.63 54.05,0.61 37.59,0.61 37.39,0.81 v37.39,1.83 | v37.39,3.86 37.39,7.32 42.47,12.39 43.74,12.39 KE04Z128.42
  Bottom 0.203: v37.39,1.83 v37.39,3.86
SWD_DIO  (via drill 0.3 pad 0.3)
  Top 0.203: JP1.7 55.27,31.5 55.07,31.29 55.07,20.73 57.3,18.49 57.3,9.96 54.25,6.91 54.25,2.03 54.05,1.83 v42.27,1.83 | v42.27,3.86 42.27,10.36 42.67,10.77 43.72,10.77 KE04Z128.44
  Bottom 0.203: v42.27,1.83 v42.27,3.86
XA0  (via drill 0.3 pad 0.3)
  Top 0.203: SRAM.37 29.05,22.14 31.09,24.18 36.78,24.18 v37.19,23.77 | KE04Z128.26 51.18,18.87 51,18.69 46.02,18.69 44.81,19.91 v44.81,22.86
  Bottom 0.203: v44.81,22.86 38.1,22.86 v37.19,23.77
XA1  (via drill 0.3 pad 0.3)
  Top 0.203: SRAM.36 29.83,22.11 31.29,23.57 36.37,23.57 v36.98,22.96 | KE04Z128.25 51.98,18.66 51.61,18.29 45.82,18.29 44.2,19.91 v44.2,22.15
  Bottom 0.203: v36.98,22.96 37.8,22.15 v44.2,22.15
XA2  (via drill 0.3 pad 0.3)
  Top 0.203: SRAM.35 30.62,22.09 31.5,22.96 35.97,22.96 v36.78,22.15 | v53.54,23.16 52.73,22.35 52.73,20.68 KE04Z128.24
  Bottom 0.203: v36.78,22.15 37.39,21.54 44.5,21.54 46.13,23.16 v53.54,23.16
XA3  (via drill 0.3 pad 0.3)
  Top 0.203: SRAM.34 31.41,21.86 31.9,22.35 35.56,22.35 v36.58,21.34 | v53.54,21.95 53.54,20.67 KE04Z128.23
  Bottom 0.203: v36.58,21.34 36.78,21.13 44.7,21.13 46.13,22.55 53.34,22.55 53.54,22.35 v53.54,21.95
XA4  (via drill 0.3 pad 0.3)
  Top 0.203: SRAM.33 32.19,21.43 32.51,21.74 35.15,21.74 v38.2,18.69 | 55.04,18.9 KE04Z128.22 55.34,18.8 53.65,18.8 53.54,18.69 v53.44,18.69
  Bottom 0.203: v38.2,18.69 v53.44,18.69
XA5  (via drill 0.3 pad 0.3)
  Top 0.203: SRAM.32 34.1,18.86 34.14,18.9 v36.37,18.9 | v54.05,18.09 55.33,18.09 KE04Z128.21
  Bottom 0.203: v36.37,18.9 36.78,18.9 37.59,18.09 v54.05,18.09
XA6  (via drill 0.3 pad 0.3)
  Top 0.203: SRAM.31 40.45,18.07 40.84,17.68 v40.84,14.43 | v54.05,11.58 55.33,11.58 KE04Z128.13
  Bottom 0.203: v40.84,14.43 53.03,14.43 53.24,14.22 53.24,12.39 v54.05,11.58
XA7  (via drill 0.3 pad 0.3)
  Top 0.203: SRAM.30 39.81,17.29 40.23,16.87 v40.23,13.82 | v52.83,11.79 52.83,11.68 53.75,10.77 55.32,10.77 KE04Z128.12
  Bottom 0.203: v40.23,13.82 52.43,13.82 52.83,13.41 v52.83,11.79
XA8  (via drill 0.3 pad 0.3)
  Top 0.203: SRAM.29 34.1,16.5 34.14,16.46 39.22,16.46 39.62,16.05 v39.62,13.21 | v52.22,12.8 52.22,11.18 52.83,10.57 52.83,9.09 KE04Z128.10
  Bottom 0.203: v39.62,13.21 51.82,13.21 v52.22,12.8
XA9  (via drill 0.3 pad 0.3)
  Top 0.203: SRAM.28 38.54,15.71 39.01,15.24 v39.01,12.39 | v51.41,12.39 51.41,10.97 52.02,10.36 52.02,9.07 KE04Z128.9
  Bottom 0.203: v39.01,12.39 v51.41,12.39
XA10  (via drill 0.3 pad 0.3)
  Top 0.203: KE04Z128.20 55.11,17.23 55.07,17.27 v54.05,17.27 | v36.37,14.94 34.06,14.94 SRAM.27
  Bottom 0.203: v54.05,17.27 36.78,17.27 36.37,16.87 v36.37,14.94
XA11  (via drill 0.3 pad 0.3)
  Top 0.203: KE04Z128.19 55.09,16.43 55.07,16.46 v54.05,16.46 | v36.98,14.12 34.06,14.12 SRAM.26
  Bottom 0.203: v54.05,16.46 37.19,16.46 36.98,16.26 v36.98,14.12
XA12  (via drill 0.3 pad 0.3)
  Top 0.203: SRAM.25 34.28,13.35 34.34,13.41 v38.2,13.41 | v54.05,13.21 55.35,13.21 KE04Z128.15
  Bottom 0.203: v38.2,13.41 38.2,14.63 38.61,15.04 53.24,15.04 53.65,14.63 53.65,13.61 v54.05,13.21
XD0  (via drill 0.3 pad 0.3)
  Top 0.203: SRAM.10 v27.47,6.54 | v46.33,7.72 46.33,8.98 KE04Z128.2
  Bottom 0.203: v27.47,6.54 28,6.54 28.45,6.1 45.92,6.1 46.33,6.5 v46.33,7.72
XD1  (via drill 0.3 pad 0.3)
  Top 0.203: v45.52,7.72 45.52,8.97 KE04Z128.1 | SRAM.11 28.26,7.1 v28.25,7.11
  Bottom 0.203: v45.52,7.72 45.52,6.91 45.11,6.5 29.46,6.5 28.85,7.11 v28.25,7.11
XD2  (via drill 0.3 pad 0.3)
  Top 0.203: SRAM.12 29.05,7.91 v29.06,7.72 | v47.14,21.95 47.14,20.67 KE04Z128.31
  Bottom 0.203: v29.06,7.72 29.06,8.94 34.54,14.43 34.54,19.91 35.36,20.73 46.74,20.73 47.14,21.13 v47.14,21.95
XD3  (via drill 0.3 pad 0.3)
  Top 0.203: v30.58,7.21 30.58,5.23 SRAM.14 | v47.95,21.95 47.95,20.66 KE04Z128.30
  Bottom 0.203: v30.58,7.21 30.58,9.86 34.95,14.22 34.95,19.71 35.56,20.32 47.55,20.32 47.95,20.73 v47.95,21.95
XD4  (via drill 0.3 pad 0.3)
  Top 0.203: SRAM.15 31.39,5.21 31.39,5.99 31.19,6.2 v31.19,8.13 | v48.77,21.95 48.77,20.65 KE04Z128.29
  Bottom 0.203: v31.19,8.13 31.19,9.86 35.36,14.02 35.36,19.51 35.76,19.91 48.36,19.91 48.77,20.32 v48.77,21.95
XD5  (via drill 0.3 pad 0.3)
  Top 0.203: SRAM.16 32.19,6.01 32,6.2 v32,7.21 | v54.05,15.65 55.37,15.65 KE04Z128.18
  Bottom 0.203: v32,7.21 32,10.06 35.36,13.41 37.39,13.41 37.59,13.61 37.59,15.34 37.9,15.65 v54.05,15.65
XD6  (via drill 0.3 pad 0.3)
  Top 0.203: KE04Z128.17 51.82,14.83 48.16,11.18 45.62,11.18 43.18,8.74 v43.18,7.11 | v35.36,7.11 34.11,7.11 SRAM.17
  Bottom 0.203: v43.18,7.11 v35.36,7.11
XD7  (via drill 0.3 pad 0.3)
  Top 0.203: KE04Z128.16 51.63,14.03 48.36,10.77 45.82,10.77 43.79,8.74 v43.79,7.82 | v35.97,7.82 34.06,7.82 SRAM.18
  Bottom 0.203: v43.79,7.82 v35.97,7.82
XMS
  Top 0.406: SRAM.40 26.68,21.81 27.03,22.15 28.2,22.15 R3.2

### Text on the board
tNames: www.happydaze.se | Wolf rev.C